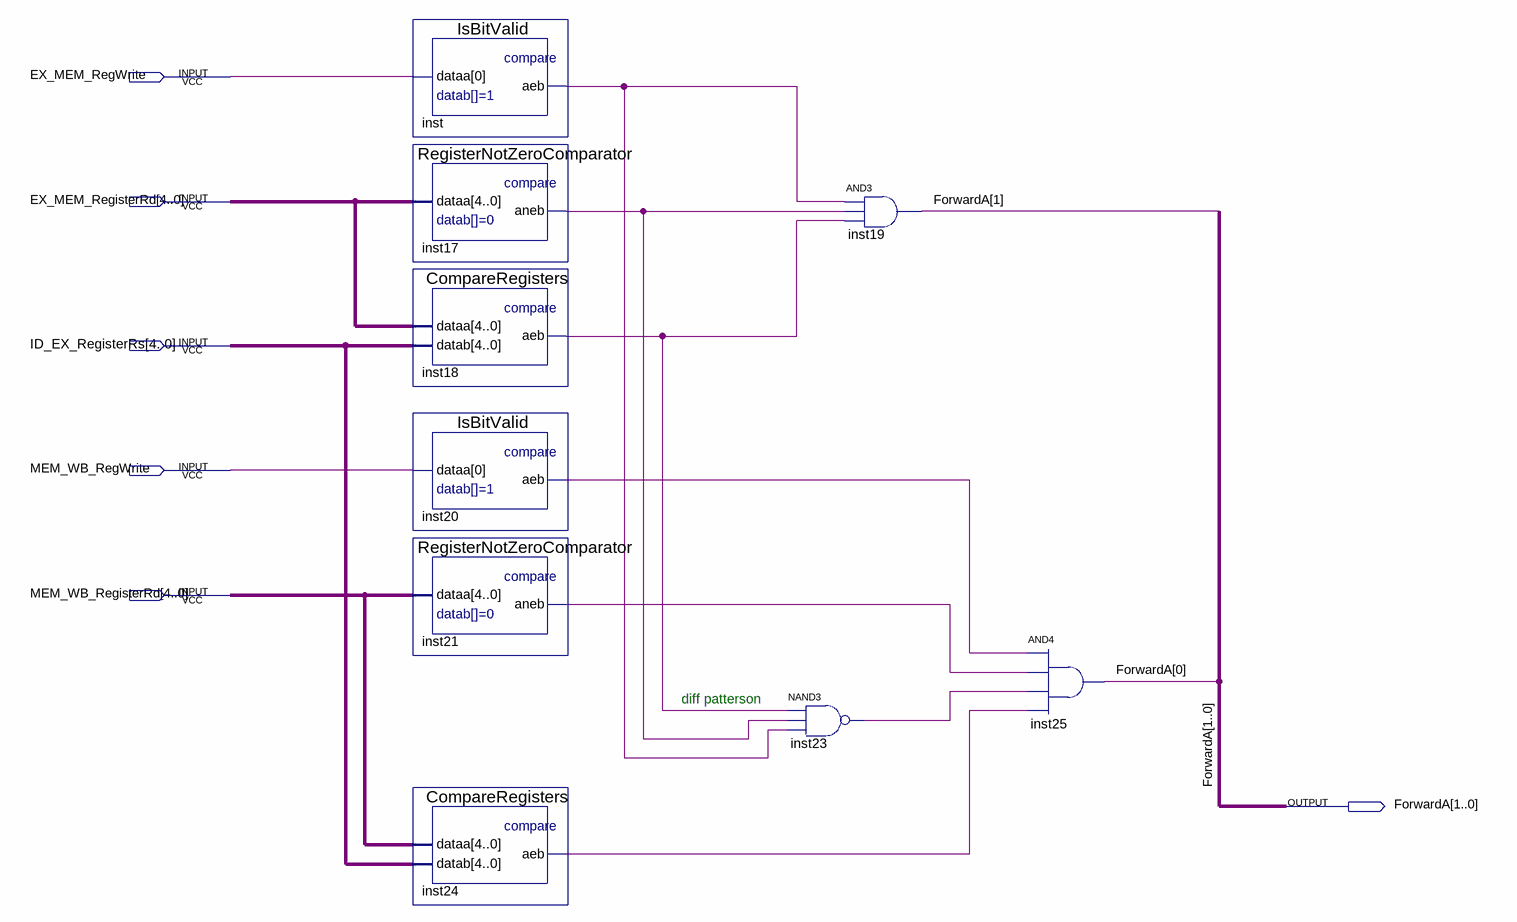
[diagram p0: schematic sheet]
// Quartus schematic ForwardAUnit.bdf as structural Verilog: 9 symbols, 6 pins
module ForwardAUnit (
  input  EX_MEM_RegWrite,
  input  [4:0] EX_MEM_RegisterRd,
  input  [4:0] ID_EX_RegisterRs,
  input  MEM_WB_RegWrite,
  input  [4:0] MEM_WB_RegisterRd,
  output [1:0] ForwardA
);

  wire inst17_aneb, inst18_aeb, inst20_aeb, inst21_aneb, inst23_out, inst24_aeb, inst_aeb;

  IsBitValid inst (.dataa(EX_MEM_RegWrite), .aeb(inst_aeb));
  RegisterNotZeroComparator inst17 (.dataa(EX_MEM_RegisterRd), .aneb(inst17_aneb));
  CompareRegisters inst18 (.dataa(EX_MEM_RegisterRd), .datab(ID_EX_RegisterRs), .aeb(inst18_aeb));
  IsBitValid inst20 (.dataa(MEM_WB_RegWrite), .aeb(inst20_aeb));
  RegisterNotZeroComparator inst21 (.dataa(MEM_WB_RegisterRd), .aneb(inst21_aneb));
  CompareRegisters inst24 (.dataa(MEM_WB_RegisterRd), .datab(ID_EX_RegisterRs), .aeb(inst24_aeb));
  nand inst23 (inst23_out, inst18_aeb, inst17_aneb, inst_aeb);
  and inst19 (ForwardA[1], inst_aeb, inst17_aneb, inst18_aeb);
  and inst25 (ForwardA[0], inst20_aeb, inst21_aneb, inst23_out, inst24_aeb);

  // Notes on the sheet:
  //   diff patterson
endmodule
